# EAGLE design lidar_robot (EAGLE 7.1.0)
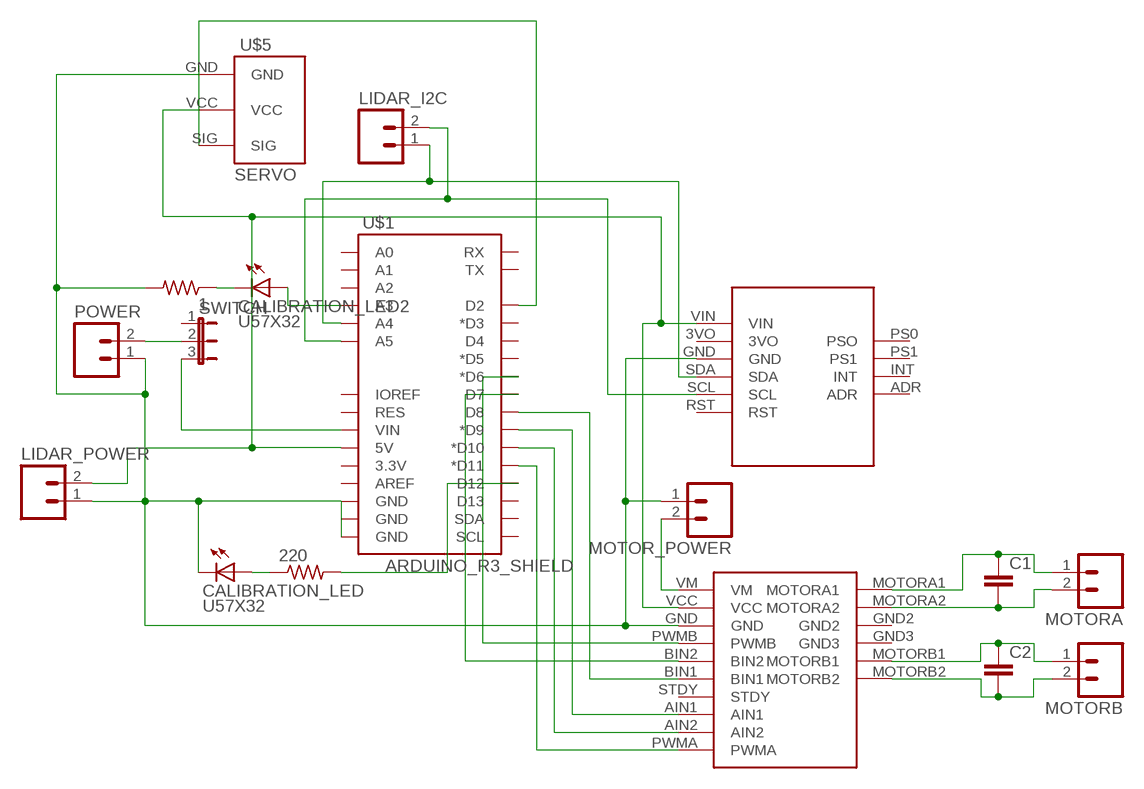
[diagram p0: schematic, sheet 1]

## Parts
1  R-US_0207/10  [0207/10]
220  R-US_0207/10  [0207/10]
C1  C2.5/4  [C2.5-4]
C2  C2.5/4  [C2.5-4]
CALIBRATION_LED  U57X32  [U57X32]
CALIBRATION_LED2  U57X32  [U57X32]
LIDAR_I2C  M02LOCK  [1X02_LOCK]
LIDAR_POWER  M02LOCK  [1X02_LOCK]
MOTOR_POWER  M02LOCK  [1X02_LOCK]
MOTORA  M02LOCK  [1X02_LOCK]
MOTORB  M02LOCK  [1X02_LOCK]
POWER  M02LOCK  [1X02_LOCK]
SWITCH  JP2E  [JP2]
U$1  ARDUINO_R3_SHIELD  [UNO_R3_SHIELD]
U$2  BN0055  [BN0055]
U$3  TB6612  [TB6612]
U$5  SERVO  [SERVO]

## Nets
N$1: POWER.2 SWITCH.2
N$2: SWITCH.3 U$1.VIN
N$3: LIDAR_POWER.2 U$1.5V U$2.VIN U$3.VCC U$5.VCC
N$4: C2.1 MOTORB.1 U$3.MOTORB1
N$5: C2.2 MOTORB.2 U$3.MOTORB2
N$6: C1.1 MOTORA.1 U$3.MOTORA1
N$7: C1.2 MOTORA.2 U$3.MOTORA2
N$8: 1.2 CALIBRATION_LED.K(C) LIDAR_POWER.1 MOTOR_POWER.1 POWER.1 U$1.GND@0(GND) U$1.GND@1(GND) U$1.GND@2(GND) U$2.GND U$3.GND U$5.GND
N$9: U$1.D11(*D11) U$3.PWMA
N$10: U$1.D10(*D10) U$3.AIN2
N$11: LIDAR_I2C.1 U$1.A4 U$2.SDA
N$12: LIDAR_I2C.2 U$1.A5 U$2.SCL
N$13: U$1.D9(*D9) U$3.AIN1
N$14: U$1.D8 U$3.BIN1
N$15: U$1.D2 U$5.SIG
N$16: 220.2 U$1.D12
N$17: U$1.D7 U$3.BIN2
N$18: 220.1 CALIBRATION_LED.A
N$19: U$1.D6(*D6) U$3.PWMB
N$20: 1.1 CALIBRATION_LED2.K(C)
N$21: CALIBRATION_LED2.A U$1.A3
N$22: MOTOR_POWER.2 U$3.VM
Unconnected: SWITCH.1 U$1.3.3V U$1.A0 U$1.A1 U$1.A2 U$1.AREF U$1.D3(*D3) U$1.D4 U$1.D5(*D5) U$1.D13 U$1.IOREF U$1.RES U$1.RX U$1.SCL U$1.SDA U$1.TX U$2.3VO U$2.ADR U$2.INT U$2.PS0(PSO) U$2.PS1 U$2.RST U$3.GND2 U$3.GND3 U$3.STDY

## Library data of the parts
1 220 = rcl:R-US_: RESISTOR, American symbol
C1 C2 = capacitor-wima:C: CAPACITOR naming: grid - package width
CALIBRATION_LED CALIBRATION_LED2 = led:U57X32: LED rectangle, 5.7 x 3.2 mm
LIDAR_I2C LIDAR_POWER MOTOR_POWER MOTORA MOTORB POWER = SparkFun:M02: Header 2 Standard 2-pin 0.1" header. Use with straight break away headers (SKU : PRT-00116), right angle break away headers (PRT-00553), swiss pins (PRT-00743), machine pins (PRT-00117), and female headers (PRT-00115). Molex polarized connector foot print use with SKU : PRT-08233 with associated crimp pins and housings.
SWITCH = jumper:JP2E: JUMPER
U$1 = SparkFun-Boards:ARDUINO_R3_SHIELD: Shield form compatible with the Arduino Uno R3.
U$2 = gabe:BN0055
U$3 = gabe:TB6612
U$5 = gabe:SERVO

## Board
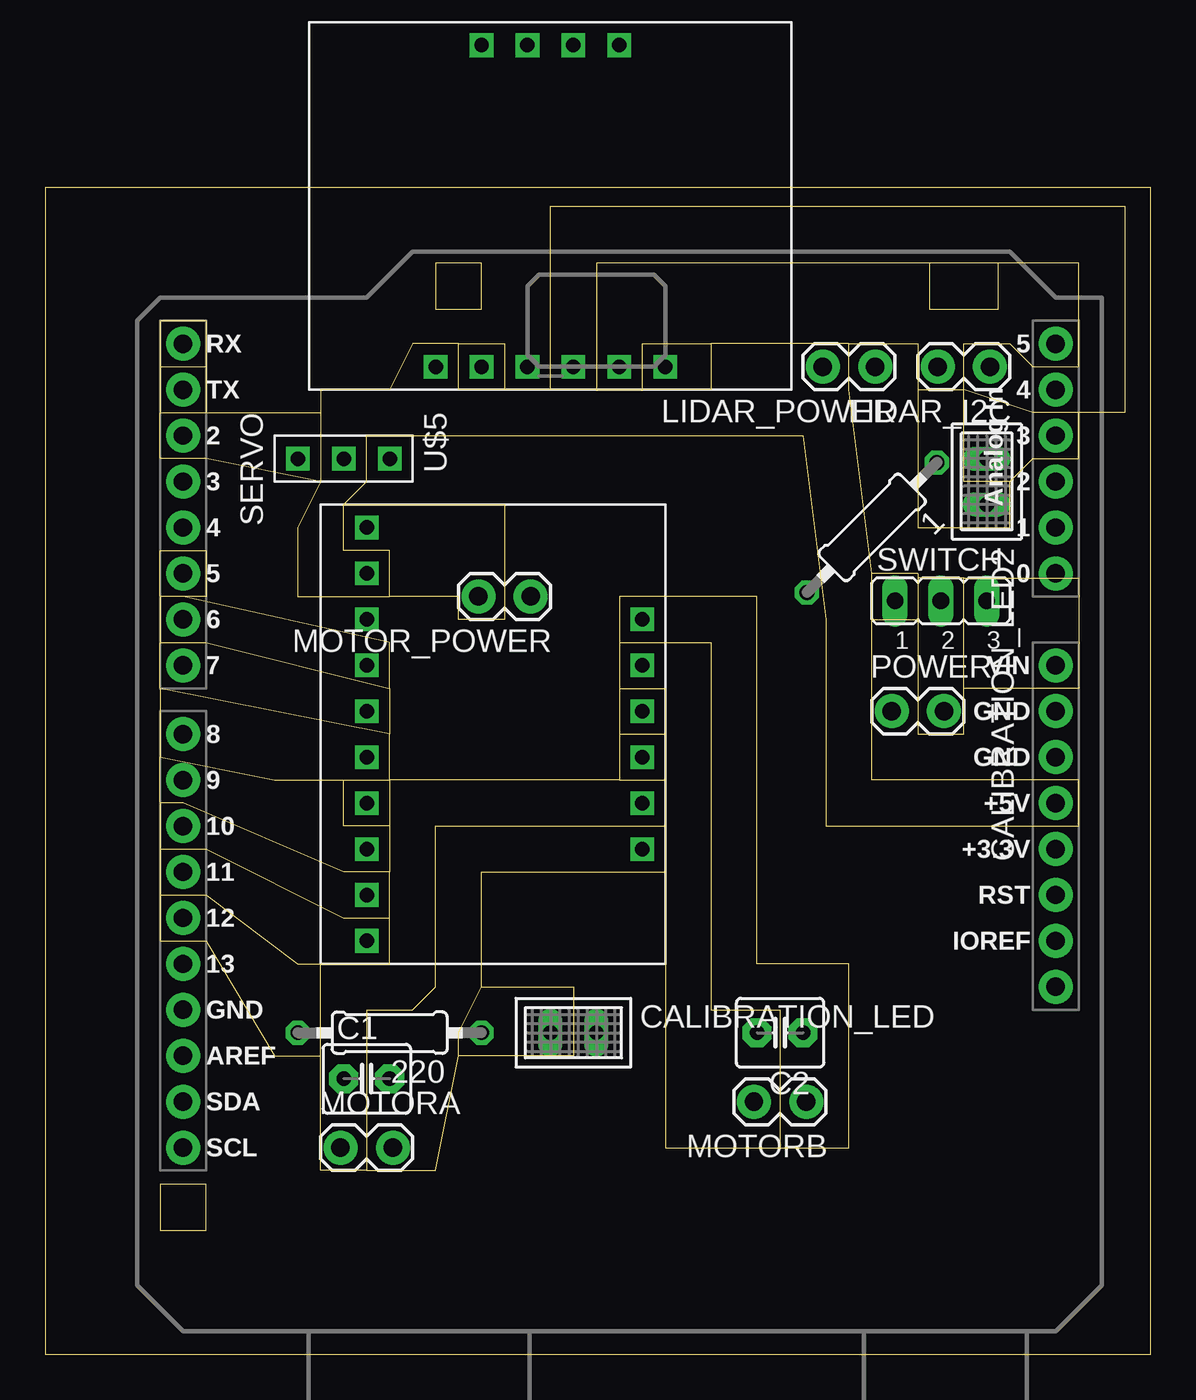
[diagram p1: board, top side]
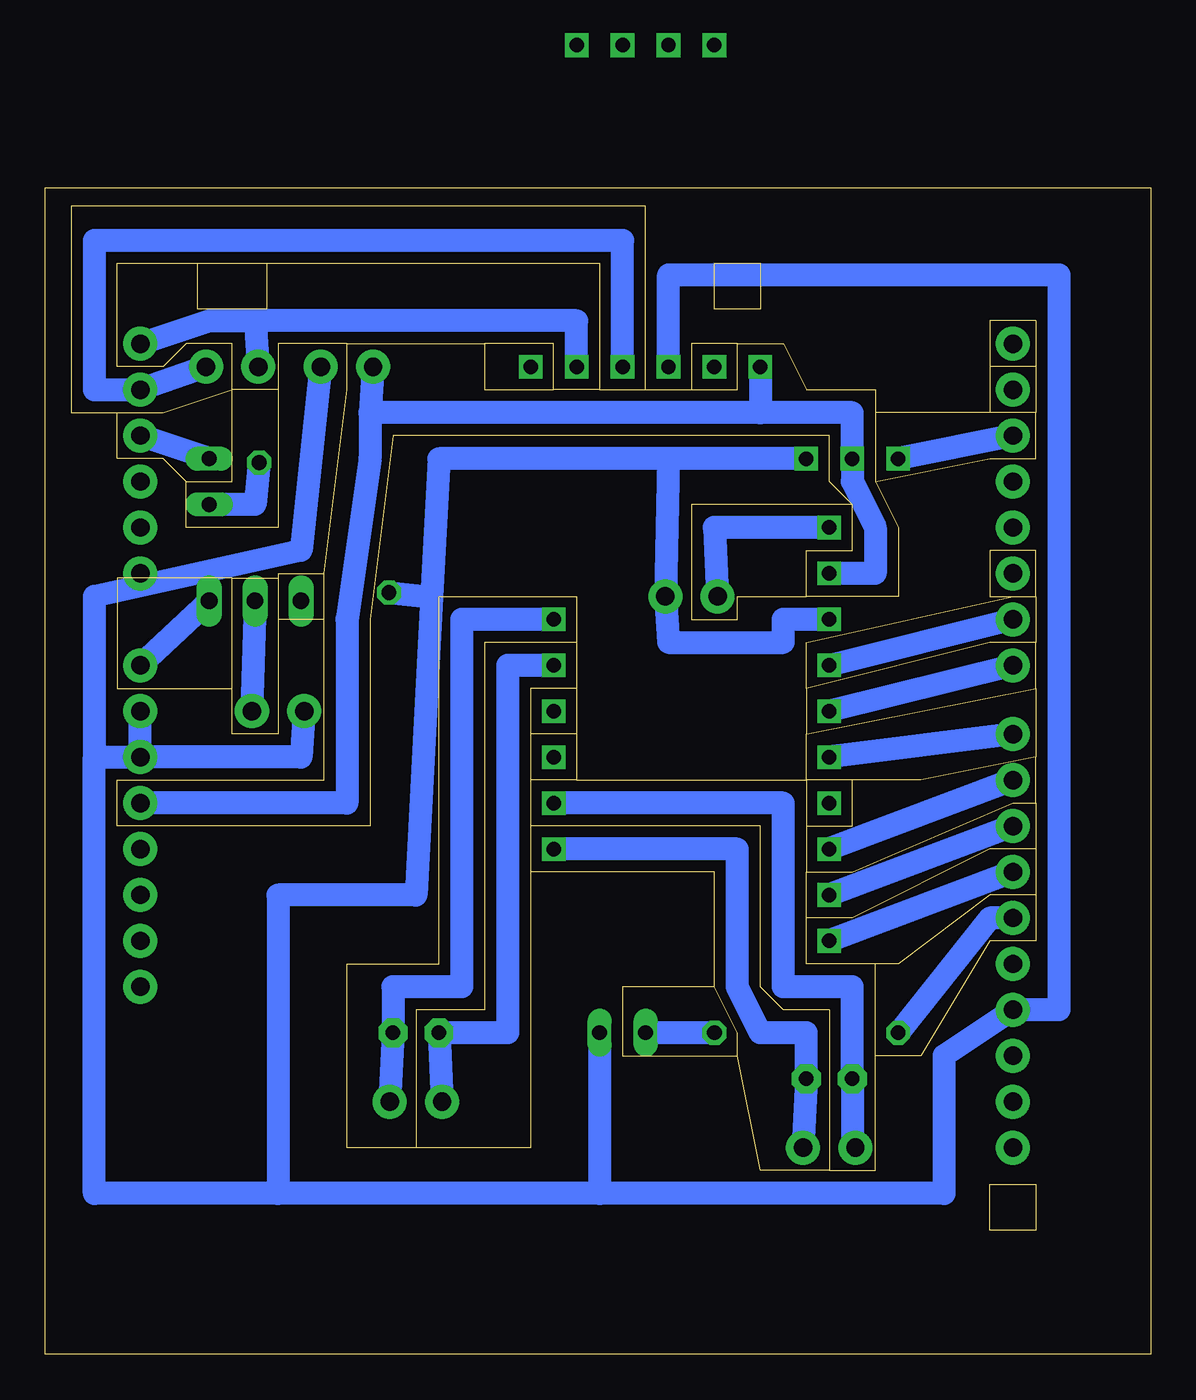
[diagram p2: board, bottom side, seen from below]

Size 61.14 x 64.51 mm. Coordinates in mm from the lower left corner, seen from the top.
Outline: 0,0 61.14,0 61.14,64.51 0,64.51 0,0
Copper layers (1*16): Top 0.035mm / dielectric 1.5mm / Bottom 0.035mm
Design rules "default": minimum track width 10mil, minimum drill 24mil, track to track 8mil, track to pad 8mil, pad to pad 8mil, via to via 8mil, smd to smd 8mil, copper to edge 40mil, drill to drill 8mil, minimum pad ring 10mil, minimum via ring 8mil, stop-mask expansion 4mil, vias tented up to drill 0mil, thermal gap 10mil
Milling: 184 lines

### Footprints (pad centres in the part's own frame; a part is rotated, then mirrored left to right if it is on the bottom)
0207/10 = drill 0.813 octagon: 1 -5.08,0; 2 5.08,0
C2.5-4 = drill 0.813 pad 1.6 octagon: 1 -1.27,0; 2 1.27,0
U57X32 = drill 0.813 long: A -1.27,0; K 1.27,0
1X02_LOCK = drill 1.016 pad 1.88: 1 -0.178,0; 2 2.718,0
JP2 = drill 0.914 long: 1 -2.54,0; 2 0,0; 3 2.54,0
UNO_R3_SHIELD = drill 1.016 pad 1.88: 3.3V 50.8,26.67; 5V 50.8,29.21; A0 50.8,41.91; A1 50.8,44.45; A2 50.8,46.99; A3 50.8,49.53; A4 50.8,52.07; A5 50.8,54.61; AREF 2.54,15.24; D2 2.54,49.53; D3 2.54,46.99; D4 2.54,44.45; D5 2.54,41.91; D6 2.54,39.37; D7 2.54,36.83; D8 2.54,33.02; D9 2.54,30.48; D10 2.54,27.94; D11 2.54,25.4; D12 2.54,22.86; D13 2.54,20.32; GND@0 50.8,31.75; GND@1 50.8,34.29; GND@2 2.54,17.78; IOREF 50.8,21.59; NC 50.8,19.05; RES 50.8,24.13; RX 2.54,54.61; SCL 2.54,10.16; SDA 2.54,12.7; TX 2.54,52.07; VIN 50.8,36.83
BN0055 = drill 0.8 square: 3VO -8.89,3.81; ADR 8.89,-3.81; GND -8.89,1.27; INT 8.89,-1.27; PS0 8.89,3.81; PS1 8.89,1.27; RST -8.89,-6.35; SCL -8.89,-3.81; SDA -8.89,-1.27; VIN -8.89,6.35
TB6612 = drill 0.8 square: AIN1 -6.35,-6.35; AIN2 -6.35,-8.89; BIN1 -6.35,-1.27; BIN2 -6.35,1.27; GND -6.35,6.35; GND2 8.89,1.27; GND3 8.89,-1.27; MOTORA1 8.89,-3.81; MOTORA2 8.89,-6.35; MOTORB1 8.89,6.35; MOTORB2 8.89,3.81; PWMA -6.35,-11.43; PWMB -6.35,3.81; STDY -6.35,-3.81; VCC -6.35,8.89; VM -6.35,11.43
SERVO = drill 0.8 square: GND 0,2.54; SIG 0,-2.54; VCC 0,0

### Placement (x,y rotation side)
1  45.72,45.72 225 top
220  19.05,17.78 180 top
C1  17.78,15.24 0 top
C2  40.64,17.78 180 top
CALIBRATION_LED  29.21,17.78 0 top
CALIBRATION_LED2  52.07,48.26 270 top
LIDAR_I2C  52.07,54.61 180 top
LIDAR_POWER  45.72,54.61 180 top
MOTOR_POWER  26.67,41.91 180 top
MOTORA  16.51,11.43 0 top
MOTORB  41.91,13.97 180 top
POWER  46.99,35.56 0 top
SWITCH  49.53,41.66 0 top
U$1  5.08,1.27 0 top
U$2  27.94,63.5 90 top
U$3  24.13,34.29 0 top
U$5  16.51,49.53 270 top

### Tracks (layer width: path | path; a pad name or v marks a point on that pad's centre or on a via)
N$1
  Bottom 1.27: SWITCH.2 POWER.2
N$2
  Bottom 1.27: SWITCH.3 U$1.VIN
N$3
  Bottom 1.27: U$3.VCC 15.24,43.18 15.24,45.72 16.51,48.26 U$5.VCC 16.51,52.07 21.59,52.07 | U$2.VIN 21.59,52.07 | 21.59,52.07 43.18,52.07 | LIDAR_POWER.2 43.18,52.07 | 43.18,52.07 43.18,49.53 44.45,40.64 44.45,30.48 U$1.5V
N$4
  Bottom 1.27: MOTORB.1 C2.1 41.91,20.32 38.1,20.32 38.1,40.64 U$3.MOTORB1
N$5
  Bottom 1.27: MOTORB.2 C2.2 35.56,17.78 35.56,38.1 U$3.MOTORB2
N$6
  Bottom 1.27: MOTORA.1 16.51,11.43 C1.1 16.51,20.32 20.32,20.32 20.32,30.48 U$3.MOTORA1
N$7
  Bottom 1.27: MOTORA.2 C1.2 19.05,17.78 21.59,17.78 22.86,20.32 22.86,27.94 U$3.MOTORA2
N$8
  Bottom 1.27: POWER.1 46.99,33.02 U$1.GND@0 | U$1.GND@0 U$1.GND@1 | U$3.GND 20.32,40.64 20.32,39.37 26.67,39.37 MOTOR_POWER.1 26.67,49.53 | 30.48,8.89 11.43,8.89 11.43,16.51 U$1.GND@2 5.08,19.05 5.08,59.69 26.67,59.69 U$2.GND | 30.48,8.89 48.26,8.89 | 48.26,8.89 58.42,8.89 58.42,33.02 | 58.42,33.02 U$1.GND@0 | 39.77,41.86 39.37,49.53 26.67,49.53 | 39.77,41.86 40.64,25.4 48.26,25.4 48.26,8.89 | CALIBRATION_LED.K 30.48,8.89 | LIDAR_POWER.1 46.99,44.45 58.42,41.91 58.42,33.02 | 1.2 39.77,41.86 | U$5.GND 26.67,49.53
N$9
  Bottom 1.27: U$1.D11 U$3.PWMA
N$10
  Bottom 1.27: U$1.D10 U$3.AIN2
N$11
  Bottom 1.27: LIDAR_I2C.1 U$1.A4 58.42,53.34 58.42,61.59 29.21,61.59 U$2.SDA
N$12
  Bottom 1.27: U$1.A5 52.07,57.15 49.53,57.15 | 49.53,57.15 LIDAR_I2C.2 | U$2.SCL 31.75,57.15 49.53,57.15
N$13
  Bottom 1.27: U$1.D9 U$3.AIN1
N$14
  Bottom 1.27: U$1.D8 U$3.BIN1
N$15
  Bottom 1.27: U$1.D2 U$5.SIG
N$16
  Bottom 1.27: U$1.D12 8.89,24.13 220.2
N$17
  Bottom 1.27: U$1.D7 U$3.BIN2
N$18
  Bottom 1.27: 220.1 CALIBRATION_LED.A
N$19
  Bottom 1.27: U$1.D6 U$3.PWMB
N$20
  Bottom 1.27: 1.1 49.53,46.99 CALIBRATION_LED2.K
N$21
  Bottom 1.27: CALIBRATION_LED2.A U$1.A3
N$22
  Bottom 1.27: U$3.VM 24.13,45.72 MOTOR_POWER.2